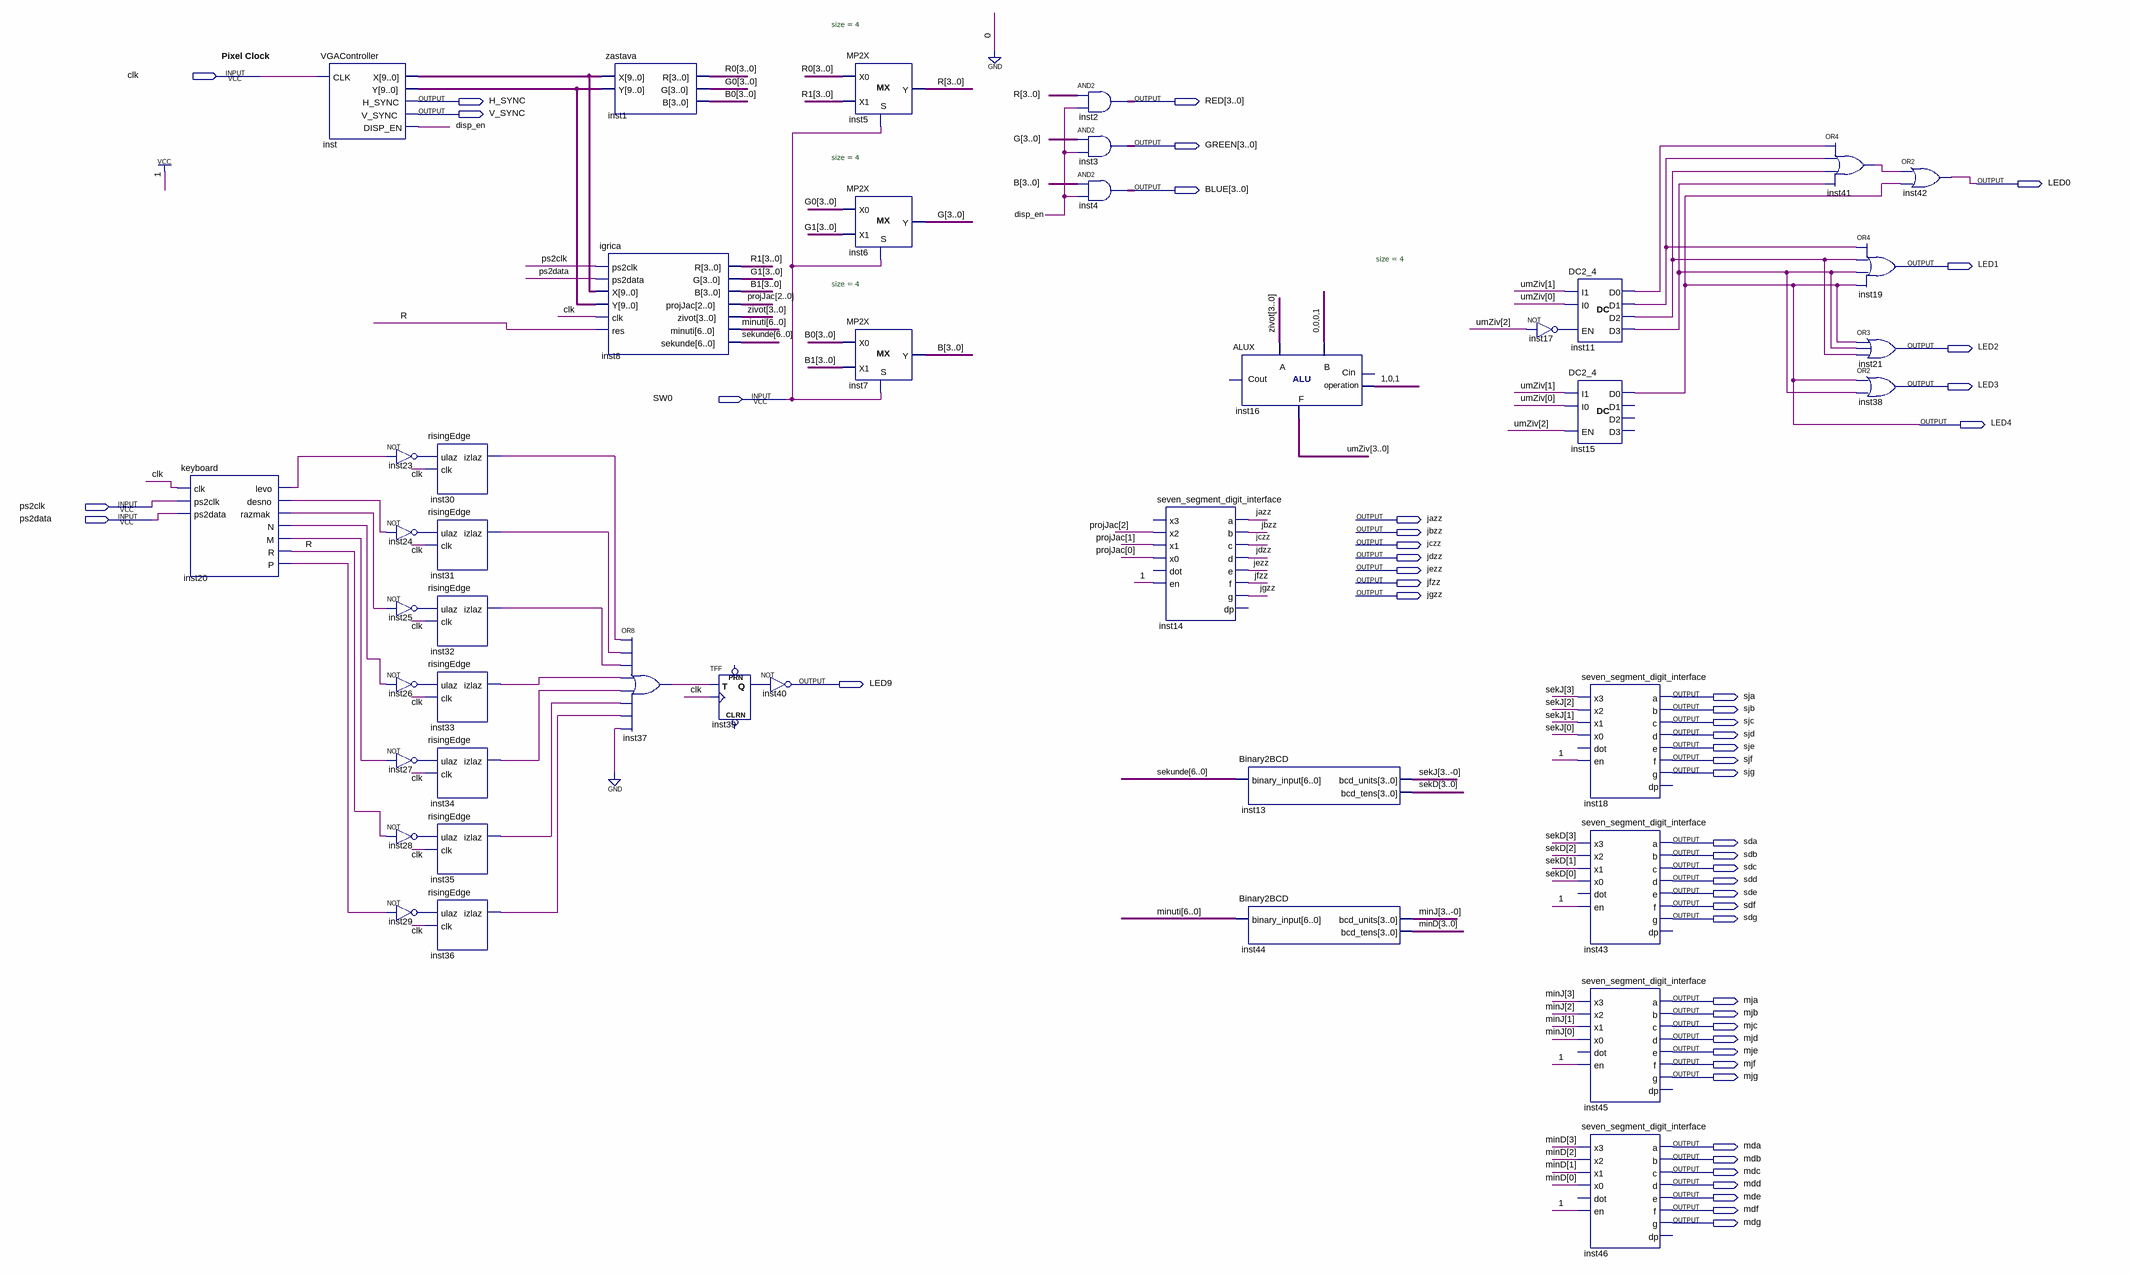
[diagram p0: schematic sheet]
// Quartus schematic Projekat.bdf as structural Verilog: 43 symbols, 50 pins
module Projekat (
  input  clk,
  input  SW0,
  input  ps2clk,
  input  ps2data,
  output H_SYNC,
  output [3:0] RED,
  output V_SYNC,
  output [3:0] GREEN,
  output LED0,
  output [3:0] BLUE,
  output LED1,
  output LED2,
  output LED3,
  output LED4,
  output jazz,
  output jbzz,
  output jczz,
  output jdzz,
  output jezz,
  output jfzz,
  output jgzz,
  output LED9,
  output sja,
  output sjb,
  output sjc,
  output sjd,
  output sje,
  output sjf,
  output sjg,
  output sda,
  output sdb,
  output sdc,
  output sdd,
  output sde,
  output sdf,
  output sdg,
  output mja,
  output mjb,
  output mjc,
  output mjd,
  output mje,
  output mjf,
  output mjg,
  output mda,
  output mdb,
  output mdc,
  output mdd,
  output mde,
  output mdf,
  output mdg
);

  wire disp_en, inst11_d0, inst11_d1, inst11_d2, inst11_d3, inst17_out, inst20_desno, inst20_levo, inst20_m,
       inst20_n, inst20_p, inst20_razmak, inst23_out, inst24_out, inst25_out, inst26_out, inst27_out,
       inst28_out, inst29_out, inst30_izlaz, inst31_izlaz, inst32_izlaz, inst33_izlaz, inst34_izlaz,
       inst35_izlaz, inst36_izlaz, inst37_out, inst39_q, inst41_out, \minJ[3..-0] , R_1bit, \sekJ[3..-0] ;
  wire [2:0] projJac;
  wire [3:0] B, B0, B1, G, G0, G1, minD, minJ, R, R0, R1, sekD, sekJ, umZiv, zivot;
  wire [6:0] minuti, sekunde;
  wire [9:0] inst_x, inst_y;

  keyboard inst20 (
    .clk(clk), .ps2clk(ps2clk), .ps2data(ps2data), .levo(inst20_levo), .desno(inst20_desno),
    .razmak(inst20_razmak), .N(inst20_n), .M(inst20_m), .R(R_1bit), .P(inst20_p));
  VGAController inst (.CLK(clk), .X(inst_x), .Y(inst_y), .H_SYNC(H_SYNC), .V_SYNC(V_SYNC), .DISP_EN(disp_en));
  not inst23 (inst23_out, inst20_levo);
  not inst24 (inst24_out, inst20_desno);
  not inst25 (inst25_out, inst20_razmak);
  not inst26 (inst26_out, inst20_n);
  not inst27 (inst27_out, inst20_m);
  not inst28 (inst28_out, R_1bit);
  not inst29 (inst29_out, inst20_p);
  risingEdge inst30 (.ulaz(inst23_out), .clk(clk), .izlaz(inst30_izlaz));
  risingEdge inst31 (.ulaz(inst24_out), .clk(clk), .izlaz(inst31_izlaz));
  risingEdge inst32 (.ulaz(inst25_out), .clk(clk), .izlaz(inst32_izlaz));
  risingEdge inst33 (.ulaz(inst26_out), .clk(clk), .izlaz(inst33_izlaz));
  risingEdge inst34 (.ulaz(inst27_out), .clk(clk), .izlaz(inst34_izlaz));
  risingEdge inst35 (.ulaz(inst28_out), .clk(clk), .izlaz(inst35_izlaz));
  risingEdge inst36 (.ulaz(inst29_out), .clk(clk), .izlaz(inst36_izlaz));
  zastava inst1 (.X(inst_x), .Y(inst_y), .R(R0), .G(G0), .B(B0));
  igrica inst8 (
    .ps2clk(ps2clk), .ps2data(ps2data), .X(inst_x), .Y(inst_y), .clk(clk), .res(R_1bit), .R(R1), .G(G1),
    .B(B1), .projJac(projJac), .zivot(zivot), .minuti(minuti), .sekunde(sekunde));
  or inst37 (inst37_out, inst30_izlaz, inst31_izlaz, inst32_izlaz, inst33_izlaz, inst34_izlaz, inst35_izlaz, inst36_izlaz, 1'b0);
  TFF inst39 (.T(inst37_out), .CLK(clk), .Q(inst39_q));  // open: PRN, CLRN
  not inst40 (LED9, inst39_q);
  MP2X #(.size(4)) inst5 (.S(SW0), .X0(R0), .X1(R1), .Y(R));
  MP2X #(.size(4)) inst6 (.S(SW0), .X0(G0), .X1(G1), .Y(G));
  MP2X #(.size(4)) inst7 (.S(SW0), .X0(B0), .X1(B1), .Y(B));
  assign RED = R & {4{disp_en}};  // AND2 inst2, 4 bits wide
  assign GREEN = G & {4{disp_en}};  // AND2 inst3, 4 bits wide
  assign BLUE = B & {4{disp_en}};  // AND2 inst4, 4 bits wide
  seven_segment_digit_interface inst14 (
    .x2(projJac[2]), .x1(projJac[1]), .x0(projJac[0]), .en(1'b1), .a(jazz), .b(jbzz), .c(jczz), .d(jdzz),
    .e(jezz), .f(jfzz), .g(jgzz));  // open: x3, dot, dp
  ALUX #(.size(4)) inst16 (.B(4'b0001), .A(zivot), .op(3'b101), .F(umZiv));  // open: Cin, Cout
  Binary2BCD inst13 (.binary_input(sekunde), .bcd_units(\sekJ[3..-0] ), .bcd_tens(sekD));
  Binary2BCD inst44 (.binary_input(minuti), .bcd_units(\minJ[3..-0] ), .bcd_tens(minD));
  not inst17 (inst17_out, umZiv[2]);
  DC2_4 inst11 (
    .I0(umZiv[0]), .I1(umZiv[1]), .EN(inst17_out), .D0(inst11_d0), .D1(inst11_d1), .D2(inst11_d2),
    .D3(inst11_d3));
  DC2_4 inst15 (.I0(umZiv[0]), .I1(umZiv[1]), .EN(umZiv[2]), .D0(LED4));  // open: D1, D2, D3
  seven_segment_digit_interface inst18 (
    .x3(sekJ[3]), .x2(sekJ[2]), .x1(sekJ[1]), .x0(sekJ[0]), .en(1'b1), .a(sja), .b(sjb), .c(sjc), .d(sjd),
    .e(sje), .f(sjf), .g(sjg));  // open: dot, dp
  seven_segment_digit_interface inst43 (
    .x3(sekD[3]), .x2(sekD[2]), .x1(sekD[1]), .x0(sekD[0]), .en(1'b1), .a(sda), .b(sdb), .c(sdc), .d(sdd),
    .e(sde), .f(sdf), .g(sdg));  // open: dot, dp
  seven_segment_digit_interface inst45 (
    .x3(minJ[3]), .x2(minJ[2]), .x1(minJ[1]), .x0(minJ[0]), .en(1'b1), .a(mja), .b(mjb), .c(mjc), .d(mjd),
    .e(mje), .f(mjf), .g(mjg));  // open: dot, dp
  seven_segment_digit_interface inst46 (
    .x3(minD[3]), .x2(minD[2]), .x1(minD[1]), .x0(minD[0]), .en(1'b1), .a(mda), .b(mdb), .c(mdc), .d(mdd),
    .e(mde), .f(mdf), .g(mdg));  // open: dot, dp
  or inst41 (inst41_out, inst11_d0, inst11_d1, inst11_d2, inst11_d3);
  or inst19 (LED1, inst11_d1, inst11_d2, inst11_d3, LED4);
  or inst21 (LED2, LED4, inst11_d3, inst11_d2);
  or inst38 (LED3, LED4, inst11_d3);
  or inst42 (LED0, inst41_out, LED4);

  // Notes on the sheet:
  //   Pixel Clock
endmodule
